# Altium schematic sheet Power_Main.SchDoc
size A
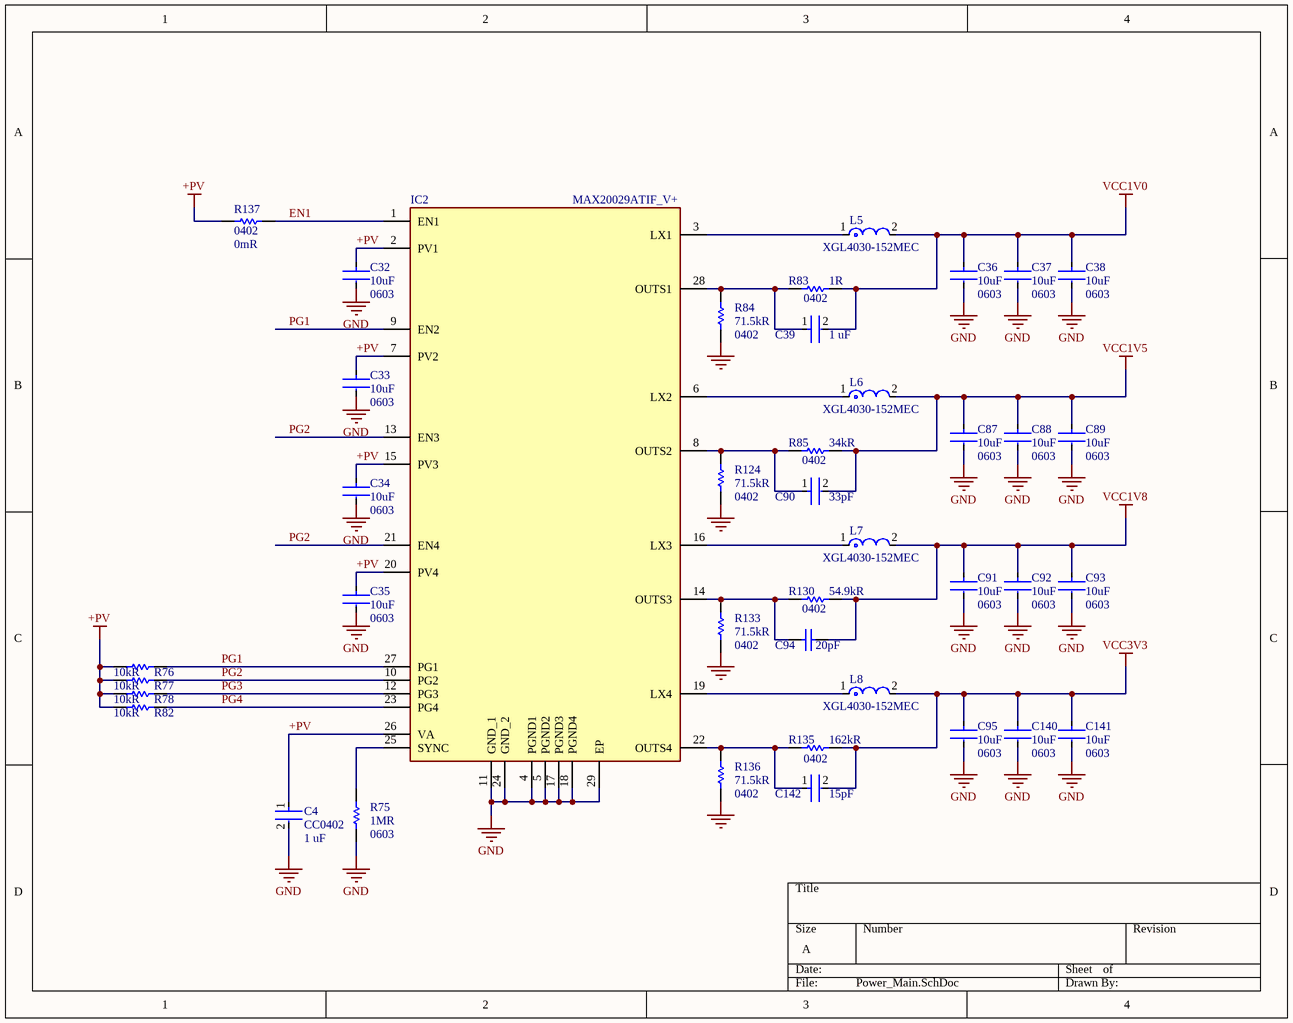
[diagram p0: Power_Main.SchDoc]

## Parts
C4  value 1 uF  Package: CC0402  [FP-CC0402-MFG]  (hidden comment: CC0402KRX5R5BB105)
C32  value 10uF  Case/Package: 0603  [FP-GRM188-0_1-e0_2_0_55-IPC_A]  (hidden comment: GRM188R60J106ME47D)
C33  value 10uF  Case/Package: 0603  [FP-GRM188-0_1-e0_2_0_55-IPC_A]  (hidden comment: GRM188R60J106ME47D)
C34  value 10uF  Case/Package: 0603  [FP-GRM188-0_1-e0_2_0_55-IPC_A]  (hidden comment: GRM188R60J106ME47D)
C35  value 10uF  Case/Package: 0603  [FP-GRM188-0_1-e0_2_0_55-IPC_A]  (hidden comment: GRM188R60J106ME47D)
C36  value 10uF  Case/Package: 0603  [FP-GRM188-0_1-e0_2_0_55-IPC_A]  (hidden comment: GRM188R60J106ME47D)
C37  value 10uF  Case/Package: 0603  [FP-GRM188-0_1-e0_2_0_55-IPC_A]  (hidden comment: GRM188R60J106ME47D)
C38  value 10uF  Case/Package: 0603  [FP-GRM188-0_1-e0_2_0_55-IPC_A]  (hidden comment: GRM188R60J106ME47D)
C39  value 1 uF  [FP-CC0402-MFG]  (hidden comment: CC0402KRX5R5BB105)
C87  value 10uF  Case/Package: 0603  [FP-GRM188-0_1-e0_2_0_55-IPC_A]  (hidden comment: GRM188R60J106ME47D)
C88  value 10uF  Case/Package: 0603  [FP-GRM188-0_1-e0_2_0_55-IPC_A]  (hidden comment: GRM188R60J106ME47D)
C89  value 10uF  Case/Package: 0603  [FP-GRM188-0_1-e0_2_0_55-IPC_A]  (hidden comment: GRM188R60J106ME47D)
C90  Capacitance: 33pF  [FP-0402-L_1_0_1-W_0_5_0_1-IPC_A]  (hidden comment: 04025A330JAT2A)
C91  value 10uF  Case/Package: 0603  [FP-GRM188-0_1-e0_2_0_55-IPC_A]  (hidden comment: GRM188R60J106ME47D)
C92  value 10uF  Case/Package: 0603  [FP-GRM188-0_1-e0_2_0_55-IPC_A]  (hidden comment: GRM188R60J106ME47D)
C93  value 10uF  Case/Package: 0603  [FP-GRM188-0_1-e0_2_0_55-IPC_A]  (hidden comment: GRM188R60J106ME47D)
C94  value 20pF  [CAPC1005X56X25NL10T15]  (hidden comment: 04025A200JAT2A)
C95  value 10uF  Case/Package: 0603  [FP-GRM188-0_1-e0_2_0_55-IPC_A]  (hidden comment: GRM188R60J106ME47D)
C140  value 10uF  Case/Package: 0603  [FP-GRM188-0_1-e0_2_0_55-IPC_A]  (hidden comment: GRM188R60J106ME47D)
C141  value 10uF  Case/Package: 0603  [FP-GRM188-0_1-e0_2_0_55-IPC_A]  (hidden comment: GRM188R60J106ME47D)
C142  value 15pF  [FP-0402-L_1_0_1-W_0_5_0_1-IPC_A]  (hidden comment: 04025A150JAT2A)
IC2  MAX20029ATIF_V+  [QFN50P500X500X80-29N]
L5  XGL4030-152MEC  [FP-XGL4030-MFG]
L6  XGL4030-152MEC  [FP-XGL4030-MFG]
L7  XGL4030-152MEC  [FP-XGL4030-MFG]
L8  XGL4030-152MEC  [FP-XGL4030-MFG]
R75  value 1MR  PackageReference: 0603  [RESC1608X55X25LL10T15]  (hidden comment: RC0603FR-071ML)
R76  value 10kR  [RESC1005X40X25LL05T10]  (hidden comment: RC0402FR-0710KL)
R77  value 10kR  [RESC1005X40X25LL05T10]  (hidden comment: RC0402FR-0710KL)
R78  value 10kR  [RESC1005X40X25LL05T10]  (hidden comment: RC0402FR-0710KL)
R82  value 10kR  [RESC1005X40X25LL05T10]  (hidden comment: RC0402FR-0710KL)
R83  value 1R  Case/Package: 0402  [RESC1005X40X25NL05T05]  (hidden comment: CRCW04021R00JNED)
R84  value 71.5kR  Case/Package: 0402  [RESC1005X40X25LL05T05]  (hidden comment: ERJ-2RKF7152X)
R85  value 34kR  Case/Package: 0402  [RESC1005X40X25ML05T05]  (hidden comment: CRCW040234K0FKED)
R124  value 71.5kR  Case/Package: 0402  [RESC1005X40X25LL05T05]  (hidden comment: ERJ-2RKF7152X)
R130  value 54.9kR  Case/Package: 0402  [RESC1005X40X25ML05T05]  (hidden comment: ERJ-2RKF5492X)
R133  value 71.5kR  Case/Package: 0402  [RESC1005X40X25LL05T05]  (hidden comment: ERJ-2RKF7152X)
R135  value 162kR  Case/Package: 0402  [RESC1005X40X25LL05T05]  (hidden comment: ERJ-2RKF1623X)
R136  value 71.5kR  Case/Package: 0402  [RESC1005X40X25LL05T05]  (hidden comment: ERJ-2RKF7152X)
R137  value 0mR  Case/Package: 0402  [RESC1005X40X25NL05T10]  (hidden comment: RC0402JR-070RL)

## Nets
+PV: C4.1 C32.1 C33.1 C34.1 C35.1 IC2.2(PV1) IC2.7(PV2) IC2.15(PV3) IC2.20(PV4) IC2.26(VA) R76.1 R77.1 R78.1 R82.1 R137.2
GND: C4.2 C32.2 C33.2 C34.2 C35.2 C36.2 C37.2 C38.2 C87.2 C88.2 C89.2 C91.2 C92.2 C93.2 C95.2 C140.2 C141.2 IC2.4(PGND1) IC2.5(PGND2) IC2.11(GND_1) IC2.17(PGND3) IC2.18(PGND4) IC2.24(GND_2) IC2.29(EP) R75.1 R84.1 R124.1 R133.1 R136.1
VCC1V0: C36.1 C37.1 C38.1 C39.2 L5.2 R83.2
VCC1V5: C87.1 C88.1 C89.1 C90.2 L6.2 R85.2
VCC1V8: C91.1 C92.1 C93.1 C94.2 L7.2 R130.2
VCC3V3: C95.1 C140.1 C141.1 C142.2 L8.2 R135.2
EN1: IC2.1(EN1) R137.1
PG1: IC2.9(EN2) IC2.27(PG1) R76.2
PG2: IC2.10(PG2) IC2.13(EN3) IC2.21(EN4) R77.2
PG3: IC2.12(PG3) R78.2
PG4: IC2.23(PG4) R82.2
NetC39_1: C39.1 IC2.28(OUTS1) R83.1 R84.2
NetC90_1: C90.1 IC2.8(OUTS2) R85.1 R124.2
NetC94_1: C94.1 IC2.14(OUTS3) R130.1 R133.2
NetC142_1: C142.1 IC2.22(OUTS4) R135.1 R136.2
NetIC2_3: IC2.3(LX1) L5.1
NetIC2_6: IC2.6(LX2) L6.1
NetIC2_16: IC2.16(LX3) L7.1
NetIC2_19: IC2.19(LX4) L8.1
NetIC2_25: IC2.25(SYNC) R75.2

## Library data of the parts
C4 C39 = CMP-2100-03591-2: CAP CER 1UF 6.3V X5R 0402; Manufacturer: YAGEO; Automotive Grade: NA; Description: CC0402 1 uF X5R 10.00% 6.3 V; Material: Ceramic; Tolerance: 0.1; Temperature Coefficient: 30ppm/°C; Voltage Rating: 6.3 V; Temperature Range Low: -55°C; Digikey Description: CAP CER 1UF 6.3V X5R 0402; Capacitance: 1 uF; Height: 0.55mm; Automotive: No; ComponentLink2URL: http://www.yageo.com/documents/recent/UPY-GP_NP0_16V-to-50V_16.pdf; Device Class L2: Capacitors; RoHS: TRUE; Temperature Range High: +125°C; Device Class L3: Ceramic Capacitors; Device Class L1: Passive Components; Temperature Characteristic: X5R; Octopart: https://octopart.com/cc0402krx5r5bb105-yageo-42244618; ComponentLink2Description: Datasheet; Temperature: -55°C to +125°C; Manufacturer Part Number: CC0402KRX5R5BB105; Mouser Description: Multilayer Ceramic Capacitors MLCC - SMD/SMT 1uF 6.3V X5R 10%; Category: Cap; Footprint Url: http://www.yageo.com/exep/pages/download/literatures/UPY-C_GEN_24.pdf; Lead Free: Yes; Ipc Land Pattern Name: CAPC10050X50; Supplier 1: Future Electronics; Supplier Part Number 1: 4193405; Stock 1: 10120000; Pricing 1: 10000=0.0084, 30000=0.0081, 50000=0.0079, 150000=0.0076, 250000=0.0074 (USD); Mounting Technology: Surface Mount; Case/Package: 0402; Pins: 2; Case Code (Imperial): 0402; Case Code (Metric): 1005; Dielectric Material: Ceramic; Min Operating Temperature: -55°C; Max Operating Temperature: 85°C; Packaging: Tape and Reel; Dielectric: X5R; Series: CC; Voltage Rating (DC): 6.3V; Termination: SMD/SMT; Length: 1mm; Width: 0.5mm; Depth: 0.5mm; Radiation Hardening: No; RoHS Compliant: Yes; Reach SVHC Compliant: No; Halogen Free: Halogen Free; ComponentLink1URL: https://datasheet.ciiva.com/5789/70765-5789520.pdf?src-supplier=Farnell; ComponentLink1Description: https://datasheet.ciiva.com/5789/70765-5789520.pdf?src-supplier=Farnell; ComponentLink3URL: https://datasheet.ciiva.com/8033/70765-8033646.pdf?src-supplier=Element14; ComponentLink3Description: https://datasheet.ciiva.com/8033/70765-8033646.pdf?src-supplier=Element14; ComponentLink4URL: https://datasheet.ciiva.com/28450/1359354-28450285.pdf?src-supplier=Element14; ComponentLink4Description: https://datasheet.ciiva.com/28450/1359354-28450285.pdf?src-supplier=Element14; ComponentLink5URL: https://datasheet.ciiva.com/176/mlccorderingcode-176610.pdf?src-supplier=Digi-Key; ComponentLink5Description: https://datasheet.ciiva.com/176/mlccorderingcode-176610.pdf?src-supplier=Digi-Key; ComponentLink6URL: https://datasheet.ciiva.com/176/mlccorderingcode-176609.pdf?src-supplier=Digi-Key; ComponentLink6Description: https://datasheet.ciiva.com/176/mlccorderingcode-176609.pdf?src-supplier=Digi-Key; ComponentLink7URL: https://datasheet.ciiva.com/176/mlccorderingcode-176611.pdf?src-supplier=Digi-Key; ComponentLink7Description: https://datasheet.ciiva.com/176/mlccorderingcode-176611.pdf?src-supplier=Digi-Key; ComponentLink8URL: https://datasheet.ciiva.com/8033/1525783-8033643.pdf?src-supplier=Element14; ComponentLink8Description: https://datasheet.ciiva.com/8033/1525783-8033643.pdf?src-supplier=Element14; ComponentLink9URL: https://datasheet.ciiva.com/8033/1525783-8033644.pdf?src-supplier=Element14; ComponentLink9Description: https://datasheet.ciiva.com/8033/1525783-8033644.pdf?src-supplier=Element14; ComponentLink10URL: https://datasheet.ciiva.com/11464/upy-gphc-x5r-4v-to-50v-12-11464863.pdf?src-supplier=Avnet; ComponentLink10Description: https://datasheet.ciiva.com/11464/upy-gphc-x5r-4v-to-50v-12-11464863.pdf?src-supplier=Avnet
  C39: Package: CC0402
C32-C38 C87-C89 C91-C93 C95 C140 C141 = CMP-2006-02792-2: Chip Multilayer Ceramic Capacitors for General Purpose, 0603, 10uF, X5R, 15%, 20%, 6.3V; Manufacturer: Murata; Packaging: Tape and Reel; Voltage Rating (DC): 6.3V; Width: 0.031inch; Termination: SMD/SMT; Dielectric: X5R; Package Quantity: 4000; Voltage Rating: 6.3V; Capacitance: 10uF; Min Operating Temperature: -55°C; Voltage: 6.3V; Length: 1.6mm; Thickness: 0.035inch; Lead Free: Lead Free; Depth: 0.8mm; Case Code (Imperial): 0603; Max Operating Temperature: 85°C; Material: Ceramic; Height: 0.8mm; Tolerance: 20%; Mount: Surface Mount; REACH SVHC: No SVHC; Radiation Hardening: No; Case Code (Metric): 1608; Supplier 1: Arrow Electronics; Supplier Part Number 1: GRM188R60J106ME47D; Manufacturer Part Number: GRM188R60J106ME47D; RoHS: Yes; Category: Ceramic Capacitors; Stock 1: 39940; Pricing 1: 1=0.1517, 10=0.0717, 25=0.0709, 100=0.0414, 250=0.0393, 500=0.0387, 1000=0.031, 3000=0.0287, 6000=0.0284, 15000=0.0223, 30000=0.0194 (USD); Mounting Technology: Surface Mount; Weight: 0.000222oz; Series: GRM; RoHS Compliant: Yes
C90 = CMP-2008-02637-2: General Purpose Ceramic Capacitor, 0402, 33pF, 5%, C0G, 30ppm/°C, 50V; Manufacturer: Kyocera AVX; Insulation Resistance: 100GR; Description: 0402 33 pF 50 V ±5% Tolerance C0G/NP0 Surface Mount Multilayer Ceramic Capacitor; REACH SVHC: No SVHC; Radiation Hardening: No; Voltage Rating (DC): 50V; Tolerance: 5%; Voltage Rating: 50V; Mount: Surface Mount; Packaging: Tape and Reel; Construction: Flat; Voltage: 50V; Case/Package: 0402; Temperature Coefficient: 30ppm/°C; Lead Free: Lead Free; Case Code (Metric): 1005; Number of Pins: 2; Min Operating Temperature: -55°C; Width: 0.5mm; Dielectric: C0G; Height: 0.5mm; Thickness: 0.022inch; Contact Plating: Tin; Length: 1mm; Package Quantity: 1; Depth: 0.5mm; Termination: SMD/SMT; Max Operating Temperature: 125°C; RoHS Compliant: Yes; Case Code (Imperial): 0402; Series: -; Supplier 1: Arrow Electronics; Supplier Part Number 1: 04025A330JAT2A; Manufacturer Part Number: 04025A330JAT2A; RoHS: Yes; Category: Ceramic Capacitors; Stock 1: 960000; Pricing 1: 10000=0.004, 20000=0.003, 50000=0.0029, 100000=0.0026 (USD); Mounting Technology: Surface Mount,PCB; Pins: 2; Value: 33pF; Reach SVHC Compliant: No
C94 = CMP-2008-02607-1: Manufacturer: AVX Interconnect / Elco; Description: 0402 50V C0G 20pF 5% multilayer ceramic capacitor; Voltage Rating: 50V; Tolerance: 5%; Dielectric: C0G; Temperature Coefficient: 0ppm/°C; Part Number: 04025A200JAT2A; Supplier 1: Arrow Electronics; Supplier Part Number 1: 04025A200JAT2A; Manufacturer Part Number: 04025A200JAT2A; RoHS: Yes; Category: Ceramic Capacitors; Stock 1: 250; Pricing 1: 1=0.167, 10=0.1274, 25=0.1157, 100=0.0796, 250=0.0494 (USD); Mounting Technology: Surface Mount; Case/Package: 0402; Pins: 2; Case Code (Metric): 1005; Case Code (Imperial): 0402; Min Operating Temperature: -55°C; Max Operating Temperature: 125°C; Packaging: Tape and Reel; Voltage Rating (DC): 50V; Series: -; Package Quantity: 1; Termination: SMD/SMT; Construction: Flat; Length: 1mm; Width: 0.02inch; Thickness: 0.022inch; Depth: 0.5mm; Radiation Hardening: No; RoHS Compliant: Yes; Reach SVHC Compliant: No; ComponentLink1URL: https://datasheet.ciiva.com/1123/425357-1123584.pdf?src-supplier=Element14; ComponentLink1Description: https://datasheet.ciiva.com/1123/425357-1123584.pdf?src-supplier=Element14; ComponentLink2URL: https://datasheet.ciiva.com/151/ccog-151792.pdf?src-supplier=Digi-Key; ComponentLink2Description: https://datasheet.ciiva.com/151/ccog-151792.pdf?src-supplier=Digi-Key; ComponentLink3URL: https://datasheet.ciiva.com/151/ccog-151793.pdf?src-supplier=Digi-Key; ComponentLink3Description: https://datasheet.ciiva.com/151/ccog-151793.pdf?src-supplier=Digi-Key; ComponentLink4URL: https://datasheet.ciiva.com/151/ccog-151794.pdf?src-supplier=Digi-Key; ComponentLink4Description: https://datasheet.ciiva.com/151/ccog-151794.pdf?src-supplier=Digi-Key; ComponentLink5URL: https://datasheet.ciiva.com/1123/425357-1123538.pdf?src-supplier=Element14; ComponentLink5Description: https://datasheet.ciiva.com/1123/425357-1123538.pdf?src-supplier=Element14; ComponentLink6URL: https://datasheet.ciiva.com/11499/ccog-11499726.pdf?src-supplier=Avnet; ComponentLink6Description: https://datasheet.ciiva.com/11499/ccog-11499726.pdf?src-supplier=Avnet; ComponentLink7URL: https://datasheet.ciiva.com/11568/ccog-11568334.pdf?src-supplier=Avnet; ComponentLink7Description: https://datasheet.ciiva.com/11568/ccog-11568334.pdf?src-supplier=Avnet; ComponentLink8URL: https://datasheet.ciiva.com/7709/84496-7709759.pdf?src-supplier=Element14; ComponentLink8Description: https://datasheet.ciiva.com/7709/84496-7709759.pdf?src-supplier=Element14
C142 = CMP-2008-02583-2: General Purpose Ceramic Capacitor, 0402, 15pF, 5%, C0G, 30ppm/°C, 50V; Manufacturer: Kyocera AVX; Description: Smd Multilayer Ceramic Capacitor, 15 Pf, 5%, C0G / Np0, 50 V, 0402 [1005 Metric] Rohs Compliant: Yes; Lead Free: Lead Free; Max Operating Temperature: 125°C; Contact Plating: Tin; Temperature Coefficient: 30ppm/°C; Number of Pins: 2; Width: 0.5mm; Voltage Rating (DC): 50V; Mount: Surface Mount; Voltage: 50V; Min Operating Temperature: -55°C; Termination: SMD/SMT; RoHS Compliant: Yes; Capacitance: 15pF; Construction: Flat; Tolerance: 5%; Case Code (Imperial): 0402; Case/Package: 0402; Dielectric: C0G; Case Code (Metric): 1005; Series: -; Length: 1mm; Height: 0.5mm; REACH SVHC: No SVHC; Package Quantity: 1; Voltage Rating: 50V; Depth: 0.5mm; Radiation Hardening: No; Thickness: 0.022inch; Packaging: Tape and Reel; Supplier 1: Arrow Electronics; Supplier Part Number 1: 04025A150JAT2A; Manufacturer Part Number: 04025A150JAT2A; RoHS: Yes; Category: Ceramic Capacitors; Stock 1: 160000; Pricing 1: 10000=0.0051, 20000=0.0049, 30000=0.0048, 40000=0.0047, 50000=0.0044, 100000=0.0038 (USD); Mounting Technology: Surface Mount,PCB; Pins: 2; Reach SVHC Compliant: No; ComponentLink1URL: https://datasheet.ciiva.com/11786/0900766b80def0e2-11786290.pdf?src-supplier=Rs; ComponentLink1Description: https://datasheet.ciiva.com/11786/0900766b80def0e2-11786290.pdf?src-supplier=Rs; ComponentLink2URL: https://datasheet.ciiva.com/28533/759117-28533749.pdf?src-supplier=Element14; ComponentLink2Description: https://datasheet.ciiva.com/28533/759117-28533749.pdf?src-supplier=Element14; ComponentLink3URL: https://datasheet.ciiva.com/1123/84496-1123526.pdf?src-supplier=Element14; ComponentLink3Description: https://datasheet.ciiva.com/1123/84496-1123526.pdf?src-supplier=Element14; ComponentLink4URL: https://datasheet.ciiva.com/1123/84496-1123527.pdf?src-supplier=Element14; ComponentLink4Description: https://datasheet.ciiva.com/1123/84496-1123527.pdf?src-supplier=Element14; ComponentLink5URL: https://datasheet.ciiva.com/14587/70001039-14587416.pdf?src-supplier=Allied+Electronics; ComponentLink5Description: https://datasheet.ciiva.com/14587/70001039-14587416.pdf?src-supplier=Allied+Electronics; ComponentLink6URL: https://datasheet.ciiva.com/156/ccog-156941.pdf?src-supplier=Digi-Key; ComponentLink6Description: https://datasheet.ciiva.com/156/ccog-156941.pdf?src-supplier=Digi-Key; ComponentLink7URL: https://datasheet.ciiva.com/156/ccog-156942.pdf?src-supplier=Digi-Key; ComponentLink7Description: https://datasheet.ciiva.com/156/ccog-156942.pdf?src-supplier=Digi-Key; ComponentLink8URL: https://datasheet.ciiva.com/2987/ccog-2987646.pdf?src-supplier=Avnet; ComponentLink8Description: https://datasheet.ciiva.com/2987/ccog-2987646.pdf?src-supplier=Avnet; ComponentLink9URL: https://datasheet.ciiva.com/7709/759117-7709534.pdf?src-supplier=Element14; ComponentLink9Description: https://datasheet.ciiva.com/7709/759117-7709534.pdf?src-supplier=Element14; ComponentLink10URL: https://datasheet.ciiva.com/156/ccog-156943.pdf?src-supplier=Digi-Key; ComponentLink10Description: https://datasheet.ciiva.com/156/ccog-156943.pdf?src-supplier=Digi-Key; ComponentLink11URL: https://datasheet.ciiva.com/2987/ccog-2987647.pdf?src-supplier=Avnet; ComponentLink11Description: https://datasheet.ciiva.com/2987/ccog-2987647.pdf?src-supplier=Avnet
IC2 = MAX20029ATIF_V+: DC to DC Converter Quad Step-Down 3V to 5.5V Automotive 28-Pin TQFN Tube; Manufacturer_Name: Analog Devices; Manufacturer_Part_Number: MAX20029ATIF/V+; Manufacturer: Maxim; Description: Switching Voltage Regulators Updated 4-ch PMIC; Datasheet Link: https://datasheets.maximintegrated.com/en/ds/MAX20029-MAX20029D.pdf; Height: 0.8mm; Mouser Part Number: 700-MAX20029ATIF/V+; Mouser Price/Stock: https://www.mouser.co.uk/ProductDetail/Maxim-Integrated/MAX20029ATIF-V%2b?qs=uwxL4vQweFOl5TBKmLtmFg%3D%3D; Arrow Part Number: MAX20029ATIF/V+; Arrow Price/Stock: https://www.arrow.com/en/products/max20029atifv/maxim-integrated?region=nac; Supplier 1: Digi-Key; Supplier Part Number 1: 175-MAX20029ATIF/V+-ND; Manufacturer Part Number: MAX20029ATIF/V+; RoHS: Yes; Category: Voltage Regulators - Switching; Pricing 1: 1=3.98, 10=3.57, 25=3.3752, 100=2.925, 250=2.775, 500=2.49, 1000=2.25 (USD)
L5-L8 = CMP-11268-000146-1: SHIELDED POWER INDUCTORS, 1.5UH
R75 = CMP-1659-00056-1: Chip Resistor, 1 MOhm, +/- 1%, 100 mW, -55 to 155 degC, 0603 (1608 Metric), RoHS, Tape and Reel; Manufacturer: Yageo; Voltage Rating (DC): 25 V; Tolerance: 20%; Case\Package: Radial; Capacitance: 1 mF; Description: Res Thick Film 0603 1M Ohm 1% 1/10W ±100ppm/°C Molded SMD Paper T/R; Power Rating: 100mW; Temperature Coefficient: 100ppm/°C; Application(s): HIGH RELIABILITY; Min Operating Temperature: -40 degC; PackageDescription: 2-Pin Surface Mount Device, Body 1.6 x 0.8 mm; ComponentLink1Description: Manufacturer URL; Radiation Hardening: No; DatasheetVersion: Rev. 4, 02/2016; REACH SVHC: No SVHC; Length: 20 mm; Max Operating Temperature: 85 degC; Diameter: 10 mm; Packaging: Bulk; Package Quantity: 200; Mount: Through Hole; ComponentLink1URL: http://www.yageo.com/; ComponentLink2URL: http://www.yageo.com/documents/recent/PYu-RC_Group_51_RoHS_L_04.pdf; ComponentLink2Description: Datasheet; Width: 0 inch; Lead Pitch: 5 mm; RoHSCompliant: true; Voltage Rating: 25 V; Height: 20 mm; Supplier 1: Future Electronics; Supplier Part Number 1: 2912863; Manufacturer Part Number: RC0603FR-071ML; RoHS: Yes; Category: Chip SMD Resistors; Stock 1: 12050000; Pricing 1: 5000=0.0015, 50000=0.0014, 200000=0.0014, 625000=0.0013, 2000000=0.0012 (USD); Case Code (Imperial): 0603; Case Code (Metric): 1608; Weight: 0.000847oz; Termination: SMD/SMT; Series: RC; Type: General Purpose; Technology: THICK FILM; RoHS Compliant: Yes; Lead Free: Lead Free; ComponentLink3URL: https://datasheet.ciiva.com/11819/0900766b80f96399-11819295.pdf?src-supplier=Rs; ComponentLink3Description: https://datasheet.ciiva.com/11819/0900766b80f96399-11819295.pdf?src-supplier=Rs; ComponentLink4URL: https://datasheet.ciiva.com/12555/rc0603-272842-12555388.pdf?src-supplier=Mouser; ComponentLink4Description: https://datasheet.ciiva.com/12555/rc0603-272842-12555388.pdf?src-supplier=Mouser; ComponentLink5URL: https://datasheet.ciiva.com/7983/443971-7983614.pdf?src-supplier=Element14; ComponentLink5Description: https://datasheet.ciiva.com/7983/443971-7983614.pdf?src-supplier=Element14
R76-R78 R82 = CMP-2002-07353-1: 10K 0402 1% 1/16W +-100PPM; Manufacturer: Yageo / Phycomp; Power Rating: 62.5mW; Max Power Dissipation: 63mW; Voltage Rating: 50V; Temperature Coefficient: 100ppm/°C; Description: Res General Purpose Thick Film 0402 10K Ohm 1% 1/16W ±100ppm/°C Molded SMD Paper T/R; Part Number: RC0402FR-0710KL; Supplier 1: Future Electronics; Supplier Part Number 1: 7468275; Manufacturer Part Number: RC0402FR-0710KL; RoHS: Yes; Category: Chip SMD Resistors; Stock 1: 2365; Pricing 1: 1=0.1, 20=0.0679, 150=0.0464, 1000=0.0261, 5000=0.0089 (USD); Case/Package: 0402; Pins: 2; Case Code (Imperial): 0402; Case Code (Metric): 1005; Min Operating Temperature: -55°C; Max Operating Temperature: 155°C; Tolerance: 1%; Packaging: Tape and Reel; Termination: SMD/SMT; Series: RC; Resistance Tolerance: 1%; Resistor Type: Thick Film; Voltage Rating (DC): 50V; Number of Terminations: 2; Features: Moisture Resistant; Construction: Rectangular; Length: 1mm; Width: 0.5mm; Depth: 0.5mm; Lead Pitch: 0.2mm; Reach SVHC Compliant: Unknown; Lead Free: Lead Free; RoHS Compliant: Yes; Military Standard: Not; ComponentLink1URL: https://datasheet.ciiva.com/7660/38568-7660787.pdf?src-supplier=Element14; ComponentLink1Description: https://datasheet.ciiva.com/7660/38568-7660787.pdf?src-supplier=Element14; ComponentLink2URL: https://datasheet.ciiva.com/7849/1686128-7849814.pdf?src-supplier=Element14; ComponentLink2Description: https://datasheet.ciiva.com/7849/1686128-7849814.pdf?src-supplier=Element14; ComponentLink3URL: https://datasheet.ciiva.com/7983/1018594-7983486.pdf?src-supplier=Element14; ComponentLink3Description: https://datasheet.ciiva.com/7983/1018594-7983486.pdf?src-supplier=Element14; ComponentLink4URL: https://datasheet.ciiva.com/22747/1018594-22747512.pdf?src-supplier=Element14; ComponentLink4Description: https://datasheet.ciiva.com/22747/1018594-22747512.pdf?src-supplier=Element14; ComponentLink5URL: https://datasheet.ciiva.com/12667/pyu-rc0402-51-rohs-l-6-r-12667067.pdf?src-supplier=Mouser; ComponentLink5Description: https://datasheet.ciiva.com/12667/pyu-rc0402-51-rohs-l-6-r-12667067.pdf?src-supplier=Mouser; ComponentLink6URL: https://datasheet.ciiva.com/7849/1784430-7849813.pdf?src-supplier=Element14; ComponentLink6Description: https://datasheet.ciiva.com/7849/1784430-7849813.pdf?src-supplier=Element14; ComponentLink7URL: https://datasheet.ciiva.com/7849/1784430-7849815.pdf?src-supplier=Element14; ComponentLink7Description: https://datasheet.ciiva.com/7849/1784430-7849815.pdf?src-supplier=Element14
R83 = CMP-1011-00002-2: Manufacturer: Vishay Dale; Description: Res Thick Film 0402 1 Ohm 5% 1/16W ±200ppm/°C Molded SMD SMD Paper T/R; Power Rating: 63mW; Temperature Coefficient: 200ppm/°C; Voltage Rating: 50V; Resistance Tolerance: 5%; Part Number: CRCW04021R00JNED; Supplier 1: Mouser; Supplier Part Number 1: 71-CRCW0402J-1.0-E3; Manufacturer Part Number: CRCW04021R00JNED; RoHS: Yes; Category: Chip SMD Resistors; Stock 1: 17590; Pricing 1: 1=0.1, 10=0.035, 50=0.035, 100=0.015, 1000=0.007, 10000=0.004 (USD); Pins: 2; Case Code (Imperial): 0402; Case Code (Metric): 1005; Contact Plating: Tin; Weight: 2.3E-05oz; Min Operating Temperature: -55°C; Max Operating Temperature: 155°C; Packaging: Tape and Reel; Voltage Rating (DC): 50V; Resistor Type: Thick Film; Series: CRCW; Tolerance: 5%; Number of Terminations: 2; Max Power Dissipation: 63mW; Features: Automotive AEC-Q200; Termination: SMD/SMT; Package Quantity: 10000; Construction: Rectangular; Length: 1mm; Width: 0.5mm; Height: 0.35mm; Depth: 0.5mm; Ratings: AEC-Q200; Radiation Hardening: No; RoHS Compliant: Yes; Reach SVHC Compliant: Unknown; Lead Free: Lead Free; Military Standard: Not; ComponentLink1URL: https://datasheet.ciiva.com/2462/dcrcwe3-2462067.pdf?src-supplier=Digi-Key; ComponentLink1Description: https://datasheet.ciiva.com/2462/dcrcwe3-2462067.pdf?src-supplier=Digi-Key; ComponentLink2URL: https://datasheet.ciiva.com/2462/dcrcwe3-2462068.pdf?src-supplier=Digi-Key; ComponentLink2Description: https://datasheet.ciiva.com/2462/dcrcwe3-2462068.pdf?src-supplier=Digi-Key; ComponentLink3URL: https://datasheet.ciiva.com/2462/dcrcwe3-2462069.pdf?src-supplier=Digi-Key; ComponentLink3Description: https://datasheet.ciiva.com/2462/dcrcwe3-2462069.pdf?src-supplier=Digi-Key; ComponentLink4URL: https://datasheet.ciiva.com/7743/dcrcwe3-7743510.pdf?src-supplier=Element14; ComponentLink4Description: https://datasheet.ciiva.com/7743/dcrcwe3-7743510.pdf?src-supplier=Element14; ComponentLink5URL: https://datasheet.ciiva.com/3256/dcrcwe3-3256201.pdf?src-supplier=Avnet; ComponentLink5Description: https://datasheet.ciiva.com/3256/dcrcwe3-3256201.pdf?src-supplier=Avnet; ComponentLink6URL: https://datasheet.ciiva.com/3256/dcrcwe3-3256202.pdf?src-supplier=Avnet; ComponentLink6Description: https://datasheet.ciiva.com/3256/dcrcwe3-3256202.pdf?src-supplier=Avnet; ComponentLink7URL: https://datasheet.ciiva.com/16436/dcrcwe3-16436175.pdf?src-supplier=Future+Electronics; ComponentLink7Description: https://datasheet.ciiva.com/16436/dcrcwe3-16436175.pdf?src-supplier=Future+Electronics
R84 R124 R133 R136 = CMP-2002-01049-1: Manufacturer: Panasonic; Description: Res Thick Film 0402 71.5K Ohm 1% 1/10W ±100ppm/°C Molded SMD Punched Carrier T/R; Power Rating: 100mW; Tolerance: 1%; Temperature Coefficient: 100ppm/°C; Voltage Rating (DC): 50V; Part Number: ERJ-2RKF7152X; Supplier 1: Mouser; Supplier Part Number 1: 667-ERJ-2RKF7152X; Manufacturer Part Number: ERJ-2RKF7152X; RoHS: Yes; Category: Chip SMD Resistors; Stock 1: 243248; Pricing 1: 1=0.1, 10=0.018, 50=0.018, 100=0.008, 1000=0.006, 10000=0.004 (USD); Mounting Technology: Surface Mount; Case Code (Metric): 1005; Case Code (Imperial): 0402; Contact Plating: Tin; Min Operating Temperature: -55°C; Max Operating Temperature: 155°C; Packaging: Tape and Reel; Number of Terminations: 2; Max Power Dissipation: 100mW; Series: ERJ; Voltage Rating: 50V; Termination: SMD/SMT; Features: Automotive AEC-Q200; Package Quantity: 10000; Resistor Type: Thick Film; Resistance Tolerance: 1%; Length: 1mm; Width: 0.5mm; Height: 0.35mm; Ratings: AEC-Q200; RoHS Compliant: Yes; Lead Free: Contains Lead; Reach SVHC Compliant: No; ComponentLink1URL: https://datasheet.ciiva.com/7861/aoa0000ce2-7861997.pdf?src-supplier=Element14; ComponentLink1Description: https://datasheet.ciiva.com/7861/aoa0000ce2-7861997.pdf?src-supplier=Element14; ComponentLink2URL: https://datasheet.ciiva.com/43467/1678782-43467469.pdf?src-supplier=Farnell; ComponentLink2Description: https://datasheet.ciiva.com/43467/1678782-43467469.pdf?src-supplier=Farnell; ComponentLink3URL: https://datasheet.ciiva.com/46372/1678782-46372878.pdf?src-supplier=Element14; ComponentLink3Description: https://datasheet.ciiva.com/46372/1678782-46372878.pdf?src-supplier=Element14; ComponentLink4URL: https://datasheet.ciiva.com/22668/1678782-22668152.pdf?src-supplier=Element14; ComponentLink4Description: https://datasheet.ciiva.com/22668/1678782-22668152.pdf?src-supplier=Element14; ComponentLink5URL: https://datasheet.ciiva.com/28592/1694929-28592264.pdf?src-supplier=Element14; ComponentLink5Description: https://datasheet.ciiva.com/28592/1694929-28592264.pdf?src-supplier=Element14; ComponentLink6URL: https://datasheet.ciiva.com/46372/1678782-46372877.pdf?src-supplier=Element14; ComponentLink6Description: https://datasheet.ciiva.com/46372/1678782-46372877.pdf?src-supplier=Element14; ComponentLink7URL: https://datasheet.ciiva.com/24027/aoa0000ce2-24027461.pdf?src-supplier=Mouser; ComponentLink7Description: https://datasheet.ciiva.com/24027/aoa0000ce2-24027461.pdf?src-supplier=Mouser; ComponentLink8URL: https://datasheet.ciiva.com/16786/70260748-16786679.pdf?src-supplier=Allied+Electronics; ComponentLink8Description: https://datasheet.ciiva.com/16786/70260748-16786679.pdf?src-supplier=Allied+Electronics; ComponentLink9URL: https://datasheet.ciiva.com/16766/70260748-16766095.pdf?src-supplier=Allied+Electronics; ComponentLink9Description: https://datasheet.ciiva.com/16766/70260748-16766095.pdf?src-supplier=Allied+Electronics
R85 = CMP-2002-08537-1: Manufacturer: Vishay Dale; Description: Res Thick Film 0402 34K Ohm 1% 0.063W(1/16W) ±100ppm/C Pad SMD Automotive T/R; Power Rating: 63mW; Tolerance: 1%; Voltage Rating: 50V; Temperature Coefficient: 100ppm/°C; Part Number: CRCW040234K0FKED; Supplier 1: Mouser; Supplier Part Number 1: 71-CRCW0402-34K-E3; Manufacturer Part Number: CRCW040234K0FKED; RoHS: Yes; Category: Chip SMD Resistors; Stock 1: 15014; Pricing 1: 1=0.1, 10=0.042, 50=0.042, 100=0.017, 1000=0.008, 10000=0.005 (USD); Case Code (Metric): 1005; Case Code (Imperial): 0402; Weight: 2.3E-05oz; Contact Plating: Tin; Min Operating Temperature: -55°C; Max Operating Temperature: 155°C; Packaging: Tape and Reel; Resistor Type: Thick Film; Number of Terminations: 2; Max Power Dissipation: 63mW; Voltage Rating (DC): 50V; Series: CRCW; Resistance Tolerance: 1%; Package Quantity: 10000; Termination: SMD/SMT; Features: Automotive AEC-Q200; Technology: THICK FILM; Length: 1mm; Width: 0.5mm; Height: 0.35mm; Depth: 0.5mm; Ratings: AEC-Q200; Radiation Hardening: No; RoHS Compliant: Yes; Reach SVHC Compliant: Unknown; Lead Free: Lead Free; ComponentLink1URL: https://datasheet.ciiva.com/2463/dcrcwe3-2463776.pdf?src-supplier=Digi-Key; ComponentLink1Description: https://datasheet.ciiva.com/2463/dcrcwe3-2463776.pdf?src-supplier=Digi-Key; ComponentLink2URL: https://datasheet.ciiva.com/2463/dcrcwe3-2463777.pdf?src-supplier=Digi-Key; ComponentLink2Description: https://datasheet.ciiva.com/2463/dcrcwe3-2463777.pdf?src-supplier=Digi-Key; ComponentLink3URL: https://datasheet.ciiva.com/7743/125364-7743605.pdf?src-supplier=Element14; ComponentLink3Description: https://datasheet.ciiva.com/7743/125364-7743605.pdf?src-supplier=Element14; ComponentLink4URL: https://datasheet.ciiva.com/5545/dcrcwe3-109170-5545798.pdf?src-supplier=Mouser; ComponentLink4Description: https://datasheet.ciiva.com/5545/dcrcwe3-109170-5545798.pdf?src-supplier=Mouser; ComponentLink5URL: https://datasheet.ciiva.com/3256/dcrcwe3-3256427.pdf?src-supplier=Avnet; ComponentLink5Description: https://datasheet.ciiva.com/3256/dcrcwe3-3256427.pdf?src-supplier=Avnet; ComponentLink6URL: https://datasheet.ciiva.com/22705/1697337-22705819.pdf?src-supplier=Element14; ComponentLink6Description: https://datasheet.ciiva.com/22705/1697337-22705819.pdf?src-supplier=Element14; ComponentLink7URL: https://datasheet.ciiva.com/3256/dcrcwe3-3256428.pdf?src-supplier=Avnet; ComponentLink7Description: https://datasheet.ciiva.com/3256/dcrcwe3-3256428.pdf?src-supplier=Avnet; ComponentLink8URL: https://datasheet.ciiva.com/16759/70201119-16759964.pdf?src-supplier=Allied+Electronics; ComponentLink8Description: https://datasheet.ciiva.com/16759/70201119-16759964.pdf?src-supplier=Allied+Electronics; ComponentLink9URL: https://datasheet.ciiva.com/7671/1697337-7671582.pdf?src-supplier=Element14; ComponentLink9Description: https://datasheet.ciiva.com/7671/1697337-7671582.pdf?src-supplier=Element14; ComponentLink10URL: https://datasheet.ciiva.com/2463/dcrcwe3-2463775.pdf?src-supplier=Digi-Key; ComponentLink10Description: https://datasheet.ciiva.com/2463/dcrcwe3-2463775.pdf?src-supplier=Digi-Key; ComponentLink11URL: https://datasheet.ciiva.com/7671/1697337-7671583.pdf?src-supplier=Element14; ComponentLink11Description: https://datasheet.ciiva.com/7671/1697337-7671583.pdf?src-supplier=Element14
R130 = CMP-2002-00991-1: Manufacturer: Panasonic; Description: Res Thick Film 0402 54.9K Ohm 1% 1/10W ±100ppm/°C Molded SMD Punched Carrier T/R; Voltage Rating: 50V; Power Rating: 100mW; Tolerance: 1%; Temperature Coefficient: 100ppm/°C; Part Number: ERJ-2RKF5492X; Supplier 1: Mouser; Supplier Part Number 1: 667-ERJ-2RKF5492X; Manufacturer Part Number: ERJ-2RKF5492X; RoHS: Yes; Category: Chip SMD Resistors; Stock 1: 154313; Pricing 1: 1=0.1, 10=0.018, 50=0.018, 100=0.008, 1000=0.006, 10000=0.004 (USD); Mounting Technology: Surface Mount; Case Code (Metric): 1005; Case Code (Imperial): 0402; Contact Plating: Tin; Min Operating Temperature: -55°C; Max Operating Temperature: 155°C; Packaging: Tape and Reel; Number of Terminations: 2; Max Power Dissipation: 100mW; Series: ERJ; Package Quantity: 10000; Termination: SMD/SMT; Voltage Rating (DC): 50V; Resistor Type: Thick Film; Features: Automotive AEC-Q200; Resistance Tolerance: 1%; Construction: Rectangular; Length: 1mm; Width: 0.5mm; Height: 0.35mm; Depth: 0.5mm; Ratings: AEC-Q200; Reach SVHC Compliant: Yes; Lead Free: Lead Free; RoHS Compliant: Yes; Military Standard: Not; ComponentLink1URL: https://datasheet.ciiva.com/9188/aoa0000ce2-9188743.pdf?src-supplier=Avnet; ComponentLink1Description: https://datasheet.ciiva.com/9188/aoa0000ce2-9188743.pdf?src-supplier=Avnet; ComponentLink2URL: https://datasheet.ciiva.com/30146/aoa0000ce2-30146855.pdf?src-supplier=Onlinecomponents.com; ComponentLink2Description: https://datasheet.ciiva.com/30146/aoa0000ce2-30146855.pdf?src-supplier=Onlinecomponents.com; ComponentLink3URL: https://datasheet.ciiva.com/7937/aoa0000ce2-7937433.pdf?src-supplier=Element14; ComponentLink3Description: https://datasheet.ciiva.com/7937/aoa0000ce2-7937433.pdf?src-supplier=Element14; ComponentLink4URL: https://datasheet.ciiva.com/9188/aoa0000ce2-9188745.pdf?src-supplier=Avnet; ComponentLink4Description: https://datasheet.ciiva.com/9188/aoa0000ce2-9188745.pdf?src-supplier=Avnet; ComponentLink5URL: https://datasheet.ciiva.com/24023/aoa0000ce2-24023851.pdf?src-supplier=Mouser; ComponentLink5Description: https://datasheet.ciiva.com/24023/aoa0000ce2-24023851.pdf?src-supplier=Mouser; ComponentLink6URL: https://datasheet.ciiva.com/16789/70260748-16789053.pdf?src-supplier=Allied+Electronics; ComponentLink6Description: https://datasheet.ciiva.com/16789/70260748-16789053.pdf?src-supplier=Allied+Electronics; ComponentLink7URL: https://datasheet.ciiva.com/16766/70260748-16766094.pdf?src-supplier=Allied+Electronics; ComponentLink7Description: https://datasheet.ciiva.com/16766/70260748-16766094.pdf?src-supplier=Allied+Electronics; ComponentLink8URL: https://datasheet.ciiva.com/46420/1678782-46420255.pdf?src-supplier=Element14; ComponentLink8Description: https://datasheet.ciiva.com/46420/1678782-46420255.pdf?src-supplier=Element14
R135 = CMP-1011-00758-2: Manufacturer: Panasonic; Description: Res Thick Film 0402 162K Ohm 1% 1/10W ±100ppm/°C Molded SMD Punched Carrier T/R; Power Rating: 100mW; Tolerance: 1%; Voltage Rating: 50V; Temperature Coefficient: 100ppm/°C; Part Number: ERJ-2RKF1623X; Supplier 1: Mouser; Supplier Part Number 1: 667-ERJ-2RKF1623X; Manufacturer Part Number: ERJ-2RKF1623X; RoHS: Yes; Category: Chip SMD Resistors; Stock 1: 125254; Pricing 1: 1=0.1, 10=0.018, 50=0.018, 100=0.008, 1000=0.006, 10000=0.003 (USD); Mounting Technology: Surface Mount; Case Code (Imperial): 0402; Case Code (Metric): 1005; Contact Plating: Tin; Weight: 2.8E-05oz; Min Operating Temperature: -55°C; Max Operating Temperature: 155°C; Packaging: Tape and Reel; Package Quantity: 10000; Resistor Type: Thick Film; Termination: SMD/SMT; Number of Terminations: 2; Max Power Dissipation: 100mW; Features: Automotive AEC-Q200; Series: ERJ; Resistance Tolerance: 1%; Voltage Rating (DC): 50V; Technology: THICK FILM; Construction: Rectangular; Length: 1mm; Width: 0.5mm; Height: 0.35mm; Depth: 0.5mm; Ratings: AEC-Q200; Radiation Hardening: No; Reach SVHC Compliant: Yes; Lead Free: Lead Free; RoHS Compliant: Yes; Military Standard: Not; ComponentLink1URL: https://datasheet.ciiva.com/7861/1678782-7861989.pdf?src-supplier=Element14; ComponentLink1Description: https://datasheet.ciiva.com/7861/1678782-7861989.pdf?src-supplier=Element14; ComponentLink2URL: https://datasheet.ciiva.com/22673/1678782-22673333.pdf?src-supplier=Element14; ComponentLink2Description: https://datasheet.ciiva.com/22673/1678782-22673333.pdf?src-supplier=Element14; ComponentLink3URL: https://datasheet.ciiva.com/22721/1678782-22721942.pdf?src-supplier=Farnell; ComponentLink3Description: https://datasheet.ciiva.com/22721/1678782-22721942.pdf?src-supplier=Farnell; ComponentLink4URL: https://datasheet.ciiva.com/16766/70260748-16766970.pdf?src-supplier=Allied+Electronics; ComponentLink4Description: https://datasheet.ciiva.com/16766/70260748-16766970.pdf?src-supplier=Allied+Electronics; ComponentLink5URL: https://datasheet.ciiva.com/43467/1678782-43467499.pdf?src-supplier=Farnell; ComponentLink5Description: https://datasheet.ciiva.com/43467/1678782-43467499.pdf?src-supplier=Farnell; ComponentLink6URL: https://datasheet.ciiva.com/16763/70260748-16763709.pdf?src-supplier=Allied+Electronics; ComponentLink6Description: https://datasheet.ciiva.com/16763/70260748-16763709.pdf?src-supplier=Allied+Electronics; ComponentLink7URL: https://datasheet.ciiva.com/46373/1678782-46373150.pdf?src-supplier=Element14; ComponentLink7Description: https://datasheet.ciiva.com/46373/1678782-46373150.pdf?src-supplier=Element14; ComponentLink8URL: https://datasheet.ciiva.com/28531/1694929-28531487.pdf?src-supplier=Element14; ComponentLink8Description: https://datasheet.ciiva.com/28531/1694929-28531487.pdf?src-supplier=Element14; ComponentLink9URL: https://datasheet.ciiva.com/46373/1678782-46373151.pdf?src-supplier=Element14; ComponentLink9Description: https://datasheet.ciiva.com/46373/1678782-46373151.pdf?src-supplier=Element14
R137 = CMP-1011-00001-2: Manufacturer: Yageo / Phycomp; Power Rating: 62.5mW; Voltage Rating: 50V; Temperature Coefficient: 200ppm/°C; Max Power Dissipation: 63mW; Tolerance: 5%; Part Number: RC0402JR-070RL; Supplier 1: Future Electronics; Supplier Part Number 1: 3375797; Manufacturer Part Number: RC0402JR-070RL; RoHS: Yes; Category: Chip SMD Resistors; Stock 1: 22430000; Pricing 1: 10000=0.0009, 50000=0.0008, 100000=0.0008, 300000=0.0008, 400000=0.0008, 1000000=0.0008, 1250000=0.0008, 3000000=0.0007, 4000000=0.0007 (USD); Case Code (Metric): 1005; Case Code (Imperial): 0402; Contact Plating: Tin,Matte; Min Operating Temperature: -55°C; Max Operating Temperature: 155°C; Packaging: Tape and Reel; Resistor Type: Thick Film; Series: RC; Package Quantity: 1; Termination: SMD/SMT; Number of Terminations: 2; Features: Moisture Resistant; Technology: THICK FILM; Resistance Tolerance: 5%; Construction: Rectangular; Length: 1mm; Width: 0.02inch; Height: 0.016inch; Depth: 0.5mm; Reach SVHC Compliant: Unknown; RoHS Compliant: Yes; Lead Free: Lead Free; Military Standard: Not; ComponentLink1URL: https://datasheet.ciiva.com/11808/0900766b80c66297-11808195.pdf?src-supplier=Rs; ComponentLink1Description: https://datasheet.ciiva.com/11808/0900766b80c66297-11808195.pdf?src-supplier=Rs; ComponentLink2URL: https://datasheet.ciiva.com/2452/pyu-rc0402-51-rohs-l-6-2452608.pdf?src-supplier=Digi-Key; ComponentLink2Description: https://datasheet.ciiva.com/2452/pyu-rc0402-51-rohs-l-6-2452608.pdf?src-supplier=Digi-Key; ComponentLink3URL: https://datasheet.ciiva.com/7983/1018594-7983535.pdf?src-supplier=Element14; ComponentLink3Description: https://datasheet.ciiva.com/7983/1018594-7983535.pdf?src-supplier=Element14; ComponentLink4URL: https://datasheet.ciiva.com/22747/1018594-22747515.pdf?src-supplier=Element14; ComponentLink4Description: https://datasheet.ciiva.com/22747/1018594-22747515.pdf?src-supplier=Element14; ComponentLink5URL: https://datasheet.ciiva.com/2452/pyu-r-int-thick-7-2452609.pdf?src-supplier=Digi-Key; ComponentLink5Description: https://datasheet.ciiva.com/2452/pyu-r-int-thick-7-2452609.pdf?src-supplier=Digi-Key; ComponentLink6URL: https://datasheet.ciiva.com/2452/pyu-r-int-thick-7-2452610.pdf?src-supplier=Digi-Key; ComponentLink6Description: https://datasheet.ciiva.com/2452/pyu-r-int-thick-7-2452610.pdf?src-supplier=Digi-Key; ComponentLink7URL: https://datasheet.ciiva.com/8896/pyu-rc0402-51-rohs-l-6-8896201.pdf?src-supplier=Avnet; ComponentLink7Description: https://datasheet.ciiva.com/8896/pyu-rc0402-51-rohs-l-6-8896201.pdf?src-supplier=Avnet